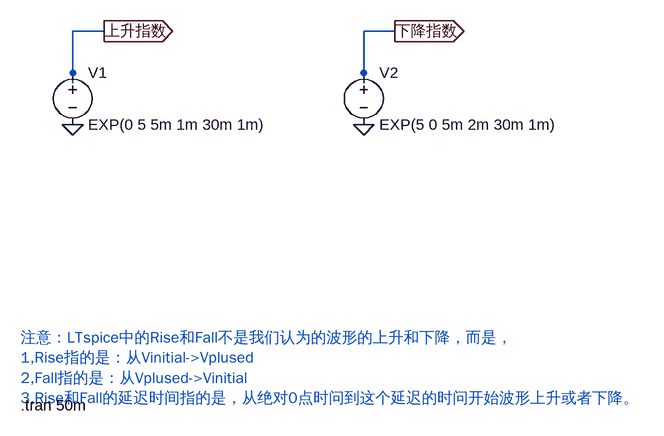
[diagram p0: schematic 05.指数波形.asc]
05.指数波形.asc, the LTspice schematic file:
Version 4
SHEET 1 880 680
WIRE 32 48 -16 48
WIRE 480 48 432 48
WIRE -16 112 -16 48
WIRE 432 112 432 48
WIRE -16 128 -16 112
WIRE 432 128 432 112
FLAG -16 192 0
FLAG 32 48 上升指数
IOPIN 32 48 Out
FLAG 432 192 0
FLAG 480 48 下降指数
IOPIN 480 48 Out
SYMBOL voltage -16 96 R0
WINDOW 123 0 0 Left 0
WINDOW 39 0 0 Left 0
SYMATTR InstName V1
SYMATTR Value EXP(0 5 5m 1m 30m 1m)
SYMBOL voltage 432 96 R0
WINDOW 123 0 0 Left 0
WINDOW 39 0 0 Left 0
SYMATTR InstName V2
SYMATTR Value EXP(5 0 5m 2m 30m 1m)
TEXT -96 520 Left 2 ;注意：LTspice中的Rise和Fall不是我们认为的波形的上升和下降，而是，\n1,Rise指的是：从Vinitial->Vplused\n2,Fall指的是：从Vplused->Vinitial\n3.Rise和Fall的延迟时间指的是，从绝对0点时问到这个延迟的时问开始波形上升或者下降。
TEXT -96 624 Left 2 !.tran 50m

The netlist it stands for:
* 05.指数波形.asc
V1 上升指数 0 EXP(0 5 5m 1m 30m 1m)
V2 下降指数 0 EXP(5 0 5m 2m 30m 1m)
* 注意：LTspice中的Rise和Fall不是我们认为的波形的上升和下降，而是，
* 1,Rise指的是：从Vinitial->Vplused
* 2,Fall指的是：从Vplused->Vinitial
* 3.Rise和Fall的延迟时间指的是，从绝对0点时问到这个延迟的时问开始波形上升或者下降。
.tran 50m
.backanno
.end